# EAGLE design boomerang (EAGLE 6.5.0)
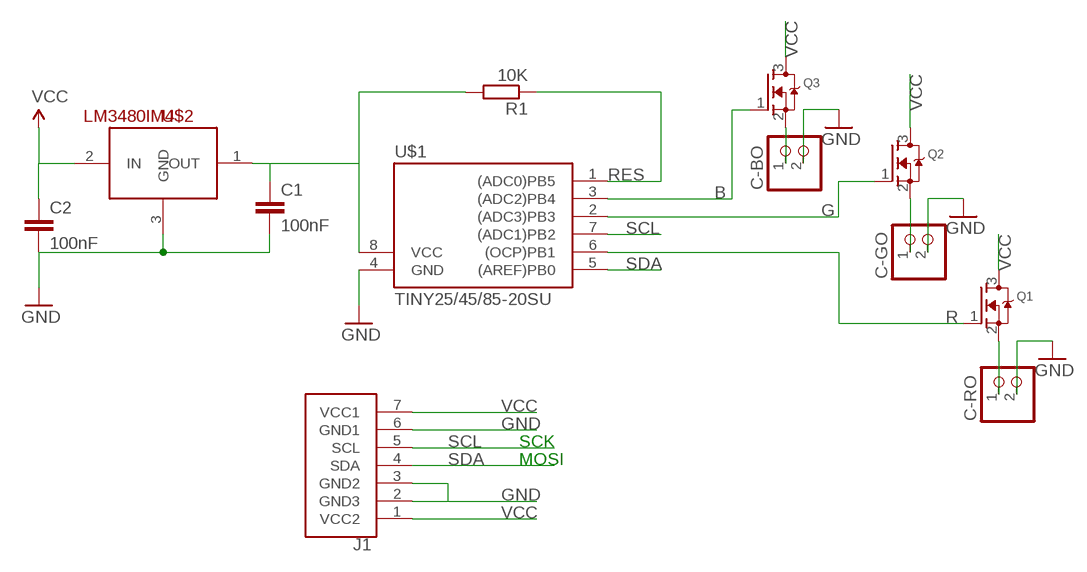
[diagram p0: schematic, sheet 1]

## Parts
C1  100nF  C-EUC0603  [C0603]
C2  100nF  C-EUC0603  [C0603]
C-BO  PINHD-1X2M  [1X02M]
C-GO  PINHD-1X2M  [1X02M]
C-RO  PINHD-1X2M  [1X02M]
J1  SATA7-RA  [SATA7-RA]
Q1  MOSFET-NREFLOW  [SOT23]
Q2  MOSFET-NREFLOW  [SOT23]
Q3  MOSFET-NREFLOW  [SOT23]
R1  10K  R-EU_R0603  [R0603]
U$1  TINY25/45/85-20SU  [SOIC8]
U$2  LM3480IM4  [SOT23-3]

## Nets
B: Q3.1(G) U$1.3((ADC2)PB4)
BO: C-BO.1 Q3.2(S)
G: Q2.1(G) U$1.2((ADC3)PB3)
GND: C1.2 C2.2 C-BO.2 C-GO.2 C-RO.2 J1.2(GND3) J1.3(GND2) J1.6(GND1) U$1.4(GND) U$2.3(GND)
GO: C-GO.1 Q2.2(S)
R: Q1.1(G) U$1.6((OCP)PB1)
RES: R1.1 U$1.1((ADC0)PB5)
RO: C-RO.1 Q1.2(S)
SCL: J1.5(SCL) U$1.7((ADC1)PB2)
SDA: J1.4(SDA) U$1.5((AREF)PB0)
VCC: C2.1 J1.1(VCC2) J1.7(VCC1) Q1.3(D) Q2.3(D) Q3.3(D) U$2.2(IN)
VCC_GOOD: C1.1 R1.2 U$1.8(VCC) U$2.1(OUT)

## Notes on the sheet
- SCK
- MOSI

## Library data of the parts
C1 C2 = resistor:C-EU: CAPACITOR, European symbol
C-BO C-GO C-RO = pinhead:PINHD-1X2: PIN HEADER
J1 = dan-pc:SATA7: SATA 7-pin connector From host perspective, A is transmit and B is receive.
Q1-Q3 = adafruit:MOSFET-N: N-Channel Mosfet 2N7002E - 60V 260mA SOT23 [Digikey: 2N7002ET1GOSTR-ND] - REEL BSH103 - 30V 850mA SOT23 [Digikey: 568-5013-1-ND]
R1 = resistor:R-EU_: RESISTOR, European symbol
U$1 = avr-7:TINY25/45/85
U$2 = SparkFun-PowerIC:LM3480IM4: Small package linear regulator

## Board
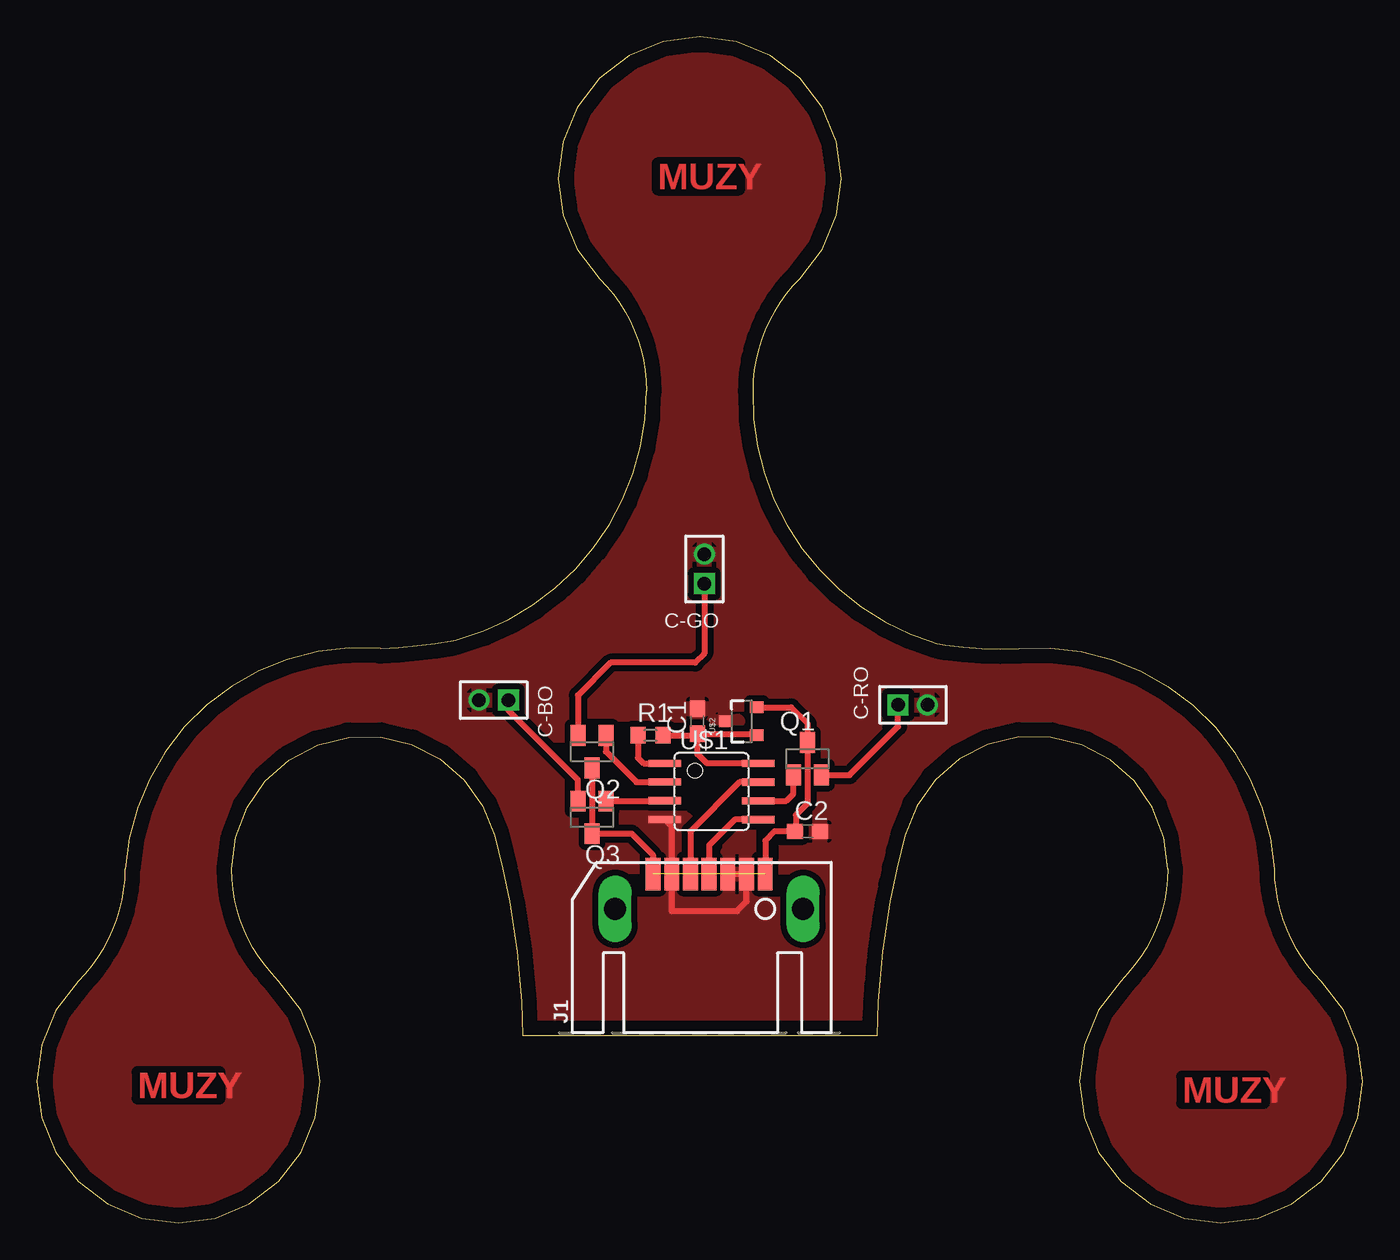
[diagram p1: board, top side]

Size 89.85 x 80.38 mm. Coordinates in mm from the lower left corner, seen from the top.
Outline: 1.29,4.8 2.81,2.81 4.8,1.29 7.11,0.33 9.6,0 12.08,0.33 14.4,1.29 16.39,2.81 17.91,4.8 18.87,7.11 19.2,9.6 18.87,12.08 17.91,14.4 16.39,16.38 15.9,16.9 15.46,17.44 15.04,18.02 14.67,18.61 14.34,19.24 14.04,19.88 13.79,20.54 13.58,21.21 13.42,21.89 13.3,22.59 13.23,23.29 13.2,24 13.47,26.14 14.25,28.16 15.48,29.94 17.1,31.37 19.02,32.39 21.12,32.91 23.28,32.93 25.39,32.43 27.31,31.45 28.95,30.04 30.21,28.28 31.02,26.27 31.3,25.16 31.57,24.04 31.81,22.92 32.02,21.79 32.22,20.66 32.39,19.53 32.54,18.39 32.66,17.25 32.76,16.11 32.84,14.97 32.9,13.82 32.93,12.68 56.92,12.68 56.95,13.82 57.01,14.97 57.09,16.11 57.19,17.25 57.31,18.39 57.46,19.53 57.63,20.66 57.83,21.79 58.04,22.92 58.28,24.04 58.55,25.16 58.83,26.27 59.64,28.28 60.9,30.04 62.54,31.45 64.46,32.43 66.57,32.93 68.73,32.91 70.83,32.39 72.75,31.37 74.37,29.94 75.6,28.16 76.38,26.14 76.65,24 76.62,23.29 76.55,22.59 76.43,21.89 76.27,21.21 76.06,20.54 75.81,19.88 75.51,19.24 75.18,18.61 74.81,18.02 74.39,17.44 73.95,16.9 73.46,16.38 71.94,14.4 70.98,12.08 70.65,9.6 70.98,7.11 71.94,4.8 73.46,2.81 75.45,1.29 77.77,0.33 80.25,0 82.73,0.33 85.05,1.29 87.04,2.81 88.56,4.8 89.52,7.11 89.85,9.6 89.52,12.08 88.56,14.4 87.04,16.38 86.56,16.9 86.11,17.44 85.7,18.02 85.32,18.61 84.99,19.24 84.69,19.88 84.44,20.54 84.24,21.21 84.07,21.89 83.95,22.59 83.88,23.29 83.85,24 83.58,26.1 83.03,28.14 82.22,30.1 81.15,31.93 79.85,33.6 78.35,35.09 76.66,36.37 74.81,37.41 72.84,38.2 70.79,38.72 68.69,38.96 66.57,38.93 65.31,38.9 64.06,38.94 62.81,39.03 61.56,39.18 61,39.28 59.22,39.91 57.51,40.73 55.9,41.74 54.41,42.91 53.06,44.24 51.86,45.71 50.82,47.3 49.97,49 49.31,50.77 48.84,52.61 48.58,54.49 48.52,56.39 48.55,57.09 48.61,57.8 48.73,58.49 48.89,59.18 49.1,59.86 49.35,60.52 49.64,61.16 49.98,61.78 50.35,62.38 50.77,62.95 51.22,63.49 51.71,64 53.24,65.99 54.2,68.3 54.52,70.78 54.2,73.27 53.24,75.58 51.71,77.57 49.72,79.1 47.41,80.06 44.92,80.38 42.44,80.06 40.13,79.1 38.14,77.57 36.61,75.58 35.65,73.27 35.33,70.78 35.65,68.3 36.61,65.99 38.14,64 38.62,63.48 39.07,62.94 39.48,62.37 39.85,61.77 40.19,61.15 40.48,60.51 40.73,59.85 40.94,59.17 41.1,58.49 41.22,57.79 41.3,57.09 41.33,56.39 41.22,54.49 40.92,52.61 40.41,50.78 39.7,49.02 38.81,47.34 37.74,45.77 36.5,44.32 35.11,43.02 33.6,41.88 31.96,40.9 30.23,40.11 28.43,39.52 28.23,39.48 27,39.28 25.77,39.12 24.52,39.01 23.28,38.93 21.16,38.96 19.06,38.72 17,38.2 15.04,37.41 13.19,36.37 11.5,35.09 9.99,33.6 8.7,31.93 7.63,30.1 6.82,28.14 6.27,26.1 6,24 5.97,23.29 5.9,22.59 5.78,21.89 5.61,21.21 5.41,20.54 5.15,19.88 4.86,19.24 4.53,18.61 4.15,18.02 3.74,17.44 3.29,16.9 2.81,16.38 1.29,14.4 0.33,12.08 0,9.6 0.33,7.11 1.29,4.8
Copper layers (1*16): Top 0.035mm / dielectric 1.5mm / Bottom 0.035mm
Design rules "default": minimum track width 10mil, minimum drill 24mil, track to track 8mil, track to pad 8mil, pad to pad 8mil, via to via 8mil, smd to smd 8mil, copper to edge 40mil, drill to drill 8mil, minimum pad ring 10mil, minimum via ring 8mil, stop-mask expansion 4mil, vias tented up to drill 0mil, thermal gap 10mil

### Footprints (pad centres in the part's own frame; a part is rotated, then mirrored left to right if it is on the bottom)
C0603 = smd 1.1 x 1: 1 -0.85,0; 2 0.85,0
1X02M = drill 0.914 square: 1 -1,0 | drill 0.914: 2 1,0
SATA7-RA = smd 2.2 x 1: 1 -4.41,3.81; 2 -4.41,2.54; 3 -4.41,1.27; 4 -4.41,0; 5 -4.41,-1.27; 6 -4.41,-2.54; 7 -4.41,-3.81 | drill 1.5 long: M1 -2.05,-6.37; M2 -2.05,6.37
SOT23 = smd 1 x 1.4: 1 -0.95,-1.1; 2 0.95,-1.1; 3 0,1.1
R0603 = smd 1 x 1.1: 1 -0.85,0; 2 0.85,0
SOIC8 = smd 0.5 x 2.2: 1 -1.905,-3.154; 2 -0.645,-3.154; 3 0.625,-3.154; 4 1.895,-3.154; 5 1.905,3.154; 6 0.635,3.154; 7 -0.635,3.154; 8 -1.905,3.154
SOT23-3 = smd 0.8 x 0.9: 1 -0.95,-1; 2 0.95,-1; 3 0,1.1

### Placement (x,y rotation side)
C1  44.77,34 90 top
C2  52.23,26.54 0 top
C-BO  30.95,35.43 180 top
C-GO  45.24,44.32 90 top
C-RO  59.37,35.11 0 top
J1  45.56,19.24 270 top
Q1  52.23,31.46 0 top
Q2  37.62,31.94 180 top
Q3  37.62,27.49 180 top
R1  41.59,33.05 0 top
U$1  45.72,29.24 270 top
U$2  47.78,34 90 top

### Tracks (layer width: path | path; a pad name or v marks a point on that pad's centre or on a via)
B
  Top 0.406: Q3.1 42.54,28.59 U$1.3
BO
  Top 0.406: 31.91,35.38 C-BO.1 31.95,34.75 36.67,30.03 Q3.2
G
  Top 0.406: Q2.1 38.57,31.94 40.64,29.87 U$1.2
GND
  Top 0.406: U$1.4 43.02,26.89 J1.6 | 43.02,23.05 J1.6 | J1.6 43.02,21.14 47.46,21.14 48.1,21.78 J1.2 J1.3
  pour Top (isolate 0.406): 43.65,97.02 121.44,-3.94 -22.07,-8.7 2.06,58.29 36.35,93.85
GO
  Top 0.406: C-GO.1 45.24,38.6 44.61,37.97 38.89,37.97 36.67,35.75 Q2.2
R
  Top 0.406: U$1.6 50.8,28.6 51.27,29.08 Q1.1
RES
  Top 0.406: R1.1 40.74,31.52 41.11,31.14 U$1.1
RO
  Top 0.406: Q1.2 53.19,30.35 55.08,30.35 58.37,33.64 C-RO.1
SCL
  Top 0.406: U$1.7 47.62,29.87 44.29,26.54 J1.5
SDA
  Top 0.406: U$1.5 47.31,27.33 45.56,25.59 J1.4
VCC  (1 unrouted)
  Top 0.406: Q2.3 Q3.3 40.32,26.38 41.75,24.95 J1.7 | U$2.2 51.12,34.95 52.23,33.84 Q1.3 52.23,28.44 51.43,27.65 51.43,26.6 C2.1 50,26.54 49.37,25.9 J1.1
VCC_GOOD
  Top 0.406: R1.2 44.66,33.05 C1.1 | C1.1 48.68,33.15 U$2.1 | U$1.8 45.4,31.14 44.77,31.78 C1.1

### Text on the board
Top: MUZY | MUZY | MUZY | MUZY